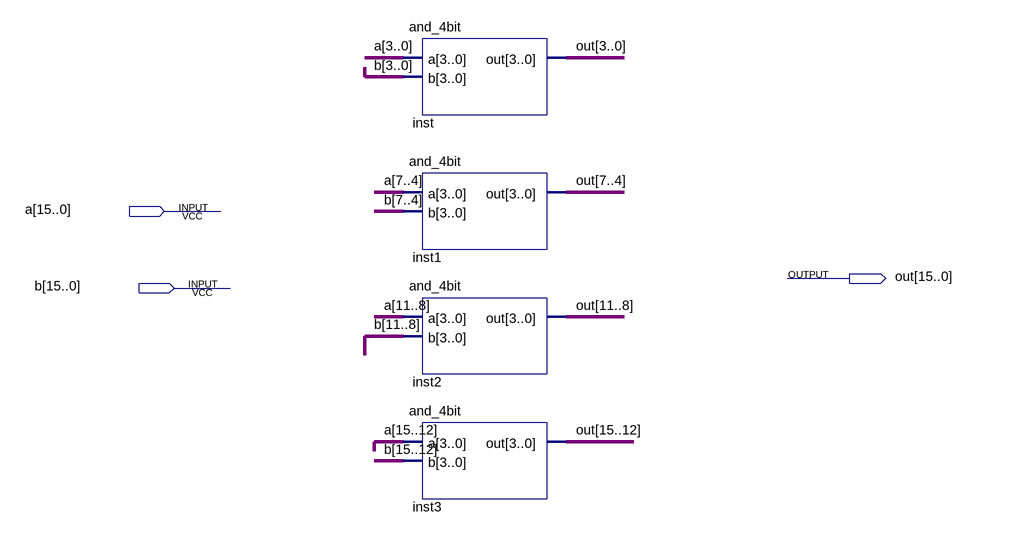
[diagram p0: schematic sheet]
// Quartus schematic and_16bit.bdf as structural Verilog: 4 symbols, 3 pins
module and_16bit (
  input  [15:0] a,
  input  [15:0] b,
  output [15:0] out
);

  and_4bit inst (.a(a[3:0]), .b(b[3:0]), .out(out[3:0]));
  and_4bit inst1 (.a(a[7:4]), .b(b[7:4]), .out(out[7:4]));
  and_4bit inst2 (.a(a[11:8]), .b(b[11:8]), .out(out[11:8]));
  and_4bit inst3 (.a(a[15:12]), .b(b[15:12]), .out(out[15:12]));
endmodule
